# EAGLE design v3.2 (EAGLE 9.4.2)
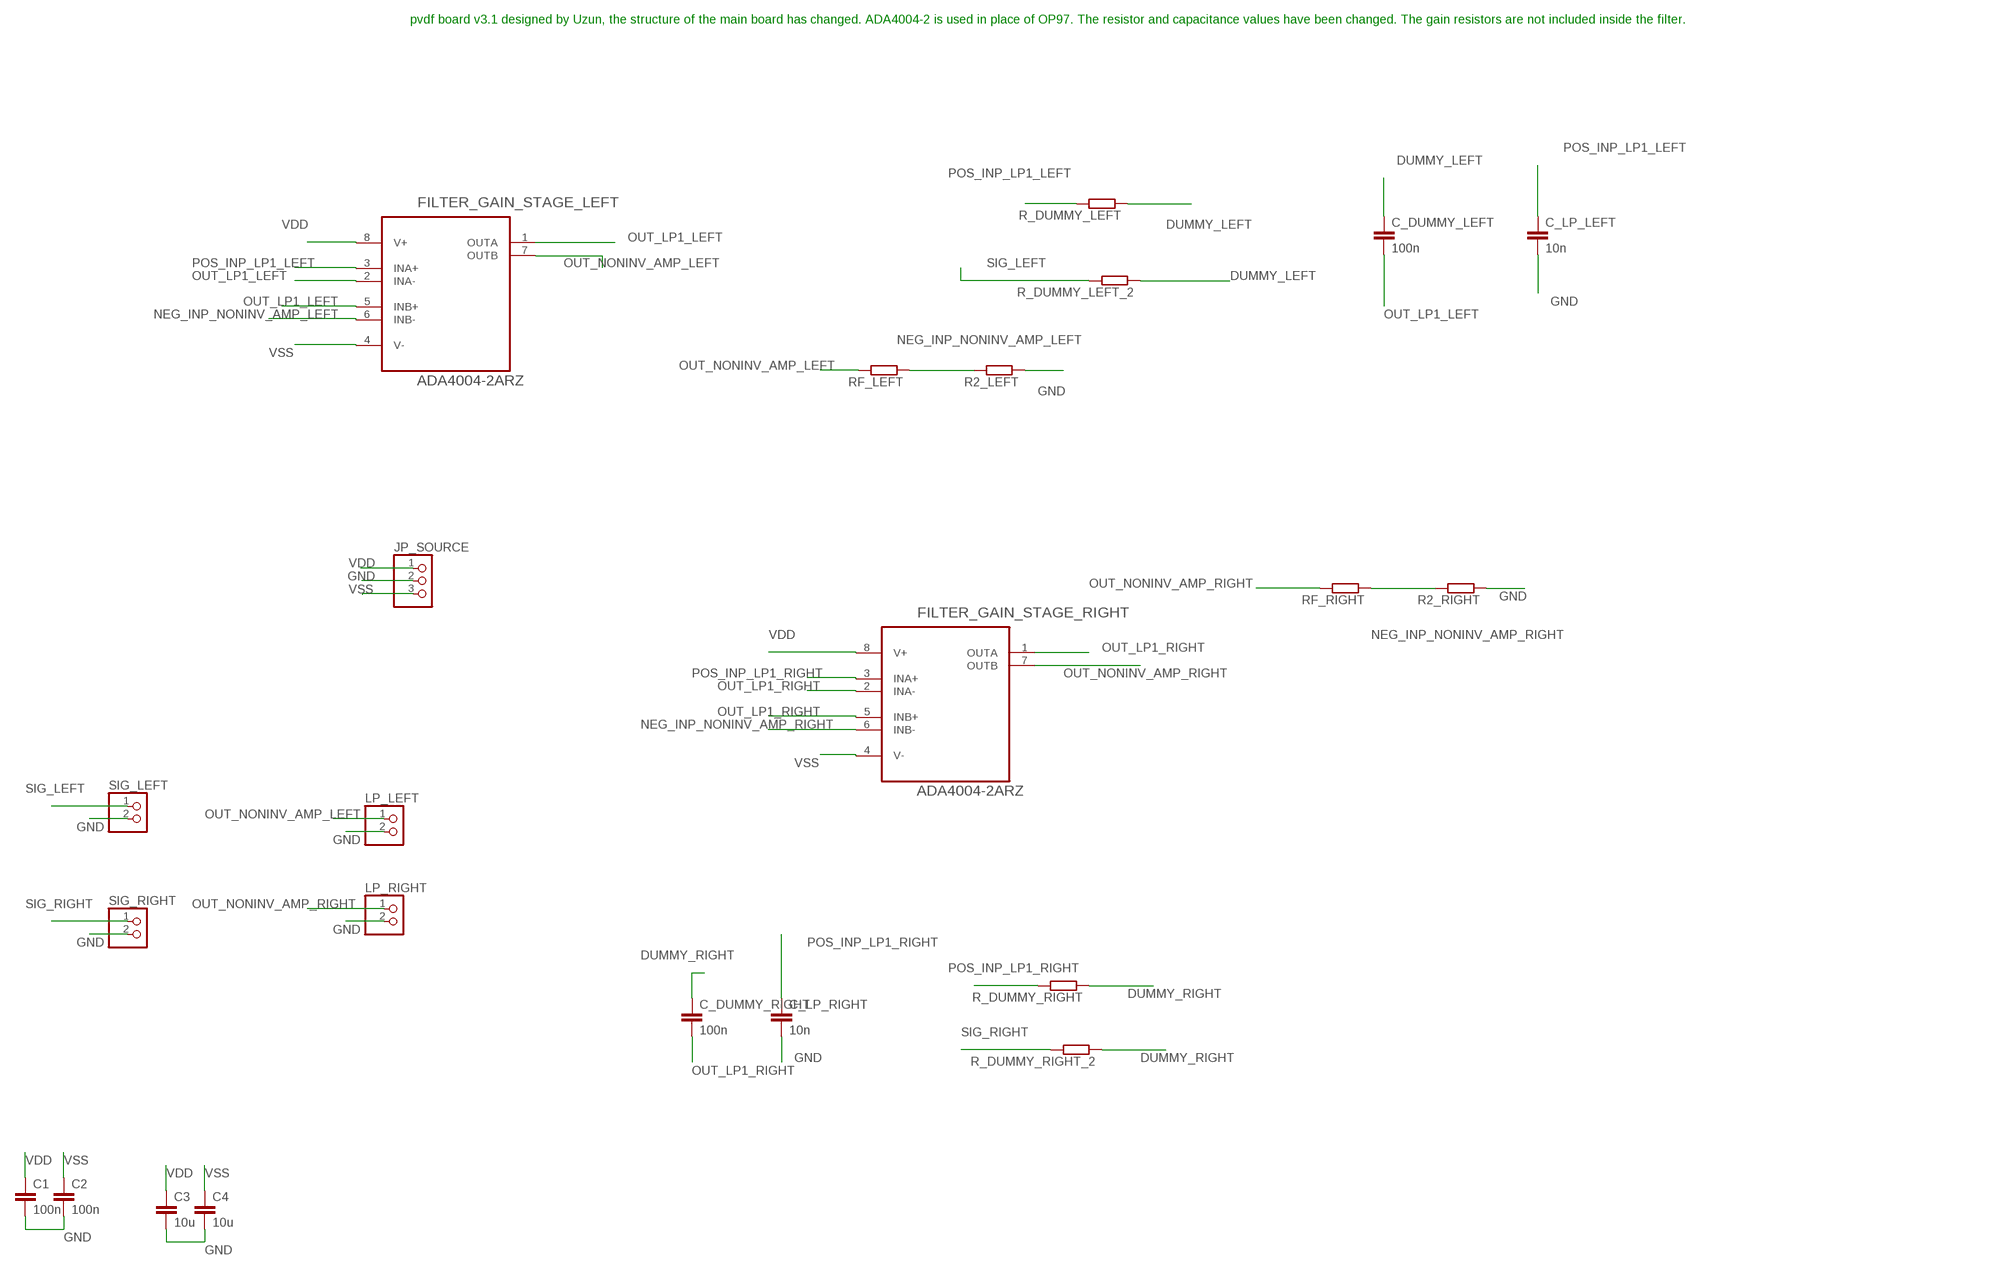
[diagram p0: schematic, sheet 1]

## Parts
C1  100n  C-EUC0805  [C0805]
C2  100n  C-EUC0805  [C0805]
C3  10u  C-EUC0805  [C0805]
C4  10u  C-EUC0805  [C0805]
C_DUMMY_LEFT  100n  C-EUC0805  [C0805]
C_DUMMY_RIGHT  100n  C-EUC0805  [C0805]
C_LP_LEFT  10n  C-EUC0805  [C0805]
C_LP_RIGHT  10n  C-EUC0805  [C0805]
FILTER_GAIN_STAGE_LEFT  ADA4004-2ARZ  [SOIC127P600X175-8N]
FILTER_GAIN_STAGE_RIGHT  ADA4004-2ARZ  [SOIC127P600X175-8N]
JP_SOURCE  PINHD-1X3  [1X03]
LP_LEFT  PINHD-1X2  [1X02]
LP_RIGHT  PINHD-1X2  [1X02]
R2_LEFT  6.8k  R-EU_M0805  [M0805]
R2_RIGHT  6.8k  R-EU_M0805  [M0805]
R_DUMMY_LEFT  1M  R-EU_M0805  [M0805]
R_DUMMY_LEFT_2  68k  R-EU_M0805  [M0805]
R_DUMMY_RIGHT  1M  R-EU_M0805  [M0805]
R_DUMMY_RIGHT_2  68k  R-EU_M0805  [M0805]
RF_LEFT  330k  R-EU_M0805  [M0805]
RF_RIGHT  330k  R-EU_M0805  [M0805]
SIG_LEFT  PINHD-1X2  [1X02]
SIG_RIGHT  PINHD-1X2  [1X02]

## Nets
DUMMY_LEFT: C_DUMMY_LEFT.1 R_DUMMY_LEFT.1 R_DUMMY_LEFT_2.1
DUMMY_RIGHT: C_DUMMY_RIGHT.1 R_DUMMY_RIGHT.1 R_DUMMY_RIGHT_2.1
GND: C1.2 C2.2 C3.2 C4.2 C_LP_LEFT.2 C_LP_RIGHT.2 JP_SOURCE.2 LP_LEFT.2 LP_RIGHT.2 R2_LEFT.1 R2_RIGHT.1 SIG_LEFT.2 SIG_RIGHT.2
NEG_INP_NONINV_AMP_LEFT: FILTER_GAIN_STAGE_LEFT.6(INB-) R2_LEFT.2 RF_LEFT.1
NEG_INP_NONINV_AMP_RIGHT: FILTER_GAIN_STAGE_RIGHT.6(INB-) R2_RIGHT.2 RF_RIGHT.1
OUT_LP1_LEFT: C_DUMMY_LEFT.2 FILTER_GAIN_STAGE_LEFT.1(OUTA) FILTER_GAIN_STAGE_LEFT.2(INA-) FILTER_GAIN_STAGE_LEFT.5(INB+)
OUT_LP1_RIGHT: C_DUMMY_RIGHT.2 FILTER_GAIN_STAGE_RIGHT.1(OUTA) FILTER_GAIN_STAGE_RIGHT.2(INA-) FILTER_GAIN_STAGE_RIGHT.5(INB+)
OUT_NONINV_AMP_LEFT: FILTER_GAIN_STAGE_LEFT.7(OUTB) LP_LEFT.1 RF_LEFT.2
OUT_NONINV_AMP_RIGHT: FILTER_GAIN_STAGE_RIGHT.7(OUTB) LP_RIGHT.1 RF_RIGHT.2
POS_INP_LP1_LEFT: C_LP_LEFT.1 FILTER_GAIN_STAGE_LEFT.3(INA+) R_DUMMY_LEFT.2
POS_INP_LP1_RIGHT: C_LP_RIGHT.1 FILTER_GAIN_STAGE_RIGHT.3(INA+) R_DUMMY_RIGHT.2
SIG_LEFT: R_DUMMY_LEFT_2.2 SIG_LEFT.1
SIG_RIGHT: R_DUMMY_RIGHT_2.2 SIG_RIGHT.1
VDD: C1.1 C3.1 FILTER_GAIN_STAGE_LEFT.8(V+) FILTER_GAIN_STAGE_RIGHT.8(V+) JP_SOURCE.1
VSS: C2.1 C4.1 FILTER_GAIN_STAGE_LEFT.4(V-) FILTER_GAIN_STAGE_RIGHT.4(V-) JP_SOURCE.3

## Notes on the sheet
- pvdf board v3.1 designed by Uzun, the structure of the main board has changed. ADA4004-2 is used in place of OP97. The resistor and capacitance values have been changed. The gain resistors are not included inside the filter.

## Library data of the parts
C1-C4 = resistor:C-EU: CAPACITOR, European symbol
C_DUMMY_LEFT C_DUMMY_RIGHT C_LP_LEFT C_LP_RIGHT = rcl:C-EU: CAPACITOR, European symbol; SPICEPREFIX: C
FILTER_GAIN_STAGE_LEFT FILTER_GAIN_STAGE_RIGHT = ADI-Phase-2:ADA4004-2ARZ: 36 V Precision Amplifiers; MPN: ADA4004-2ARZ; OC_FARNELL: 2077697; OC_NEWARK: 34P2953; PACKAGE: SOIC-8; SUPPLIER: Analog Devices
JP_SOURCE = pinhead:PINHD-1X3: PIN HEADER
LP_LEFT LP_RIGHT SIG_LEFT SIG_RIGHT = pinhead:PINHD-1X2: PIN HEADER
R2_LEFT R2_RIGHT R_DUMMY_LEFT R_DUMMY_LEFT_2 R_DUMMY_RIGHT R_DUMMY_RIGHT_2 RF_LEFT RF_RIGHT = rcl:R-EU_: RESISTOR, European symbol; SPICEPREFIX: R

## Board
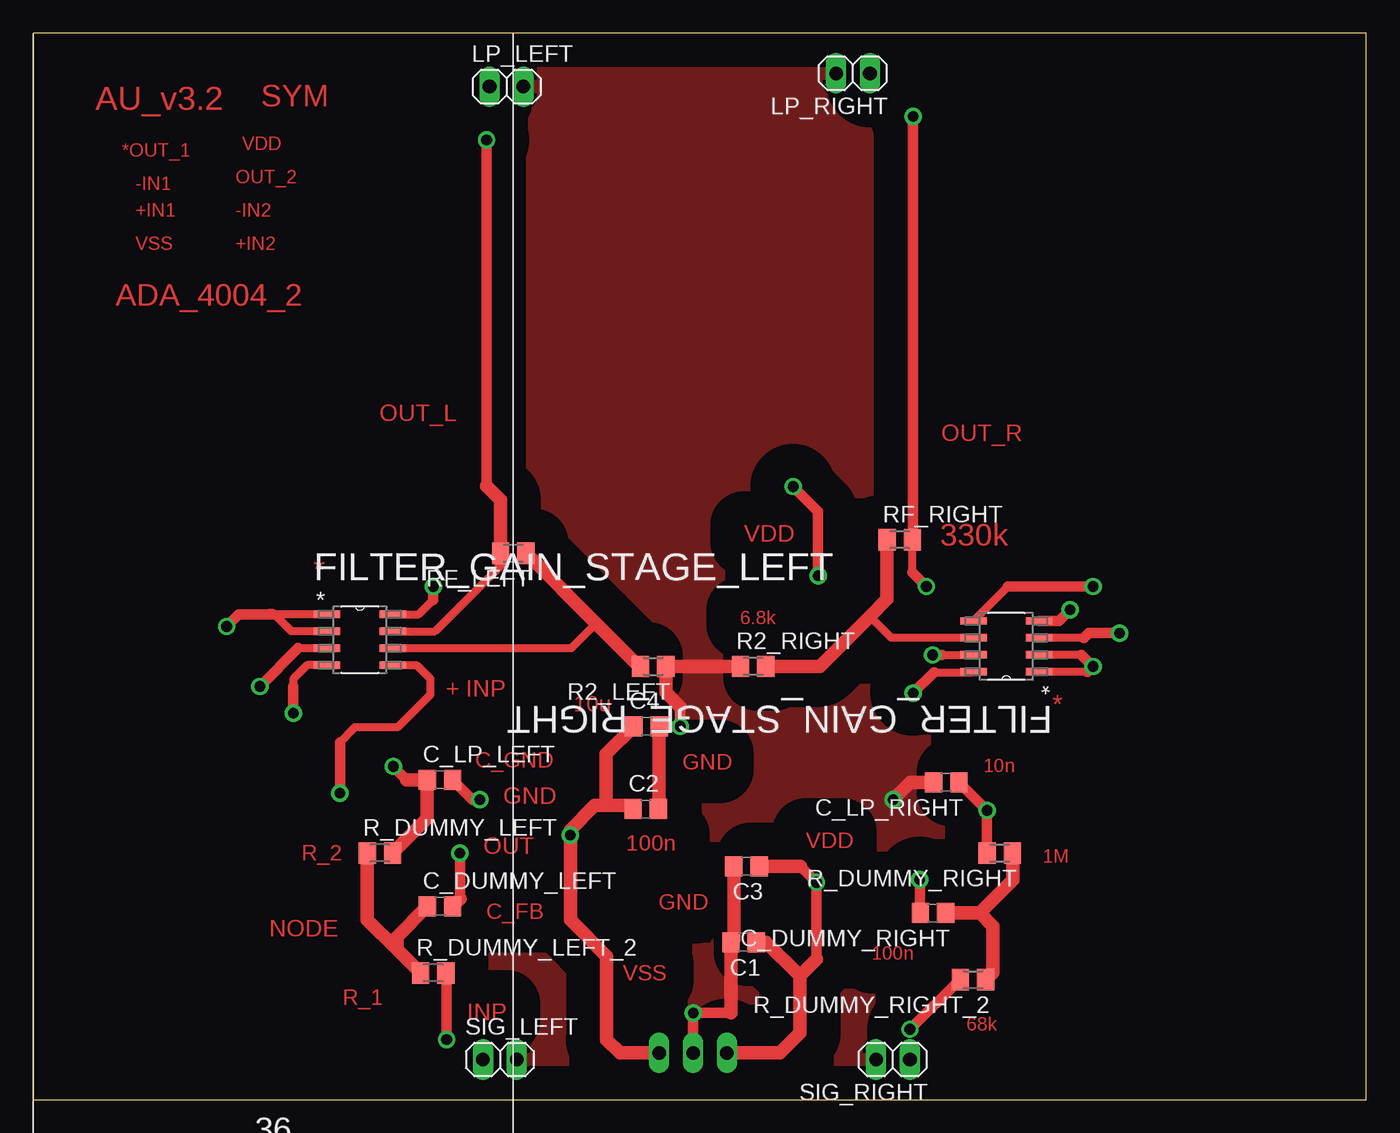
[diagram p1: board, top side]
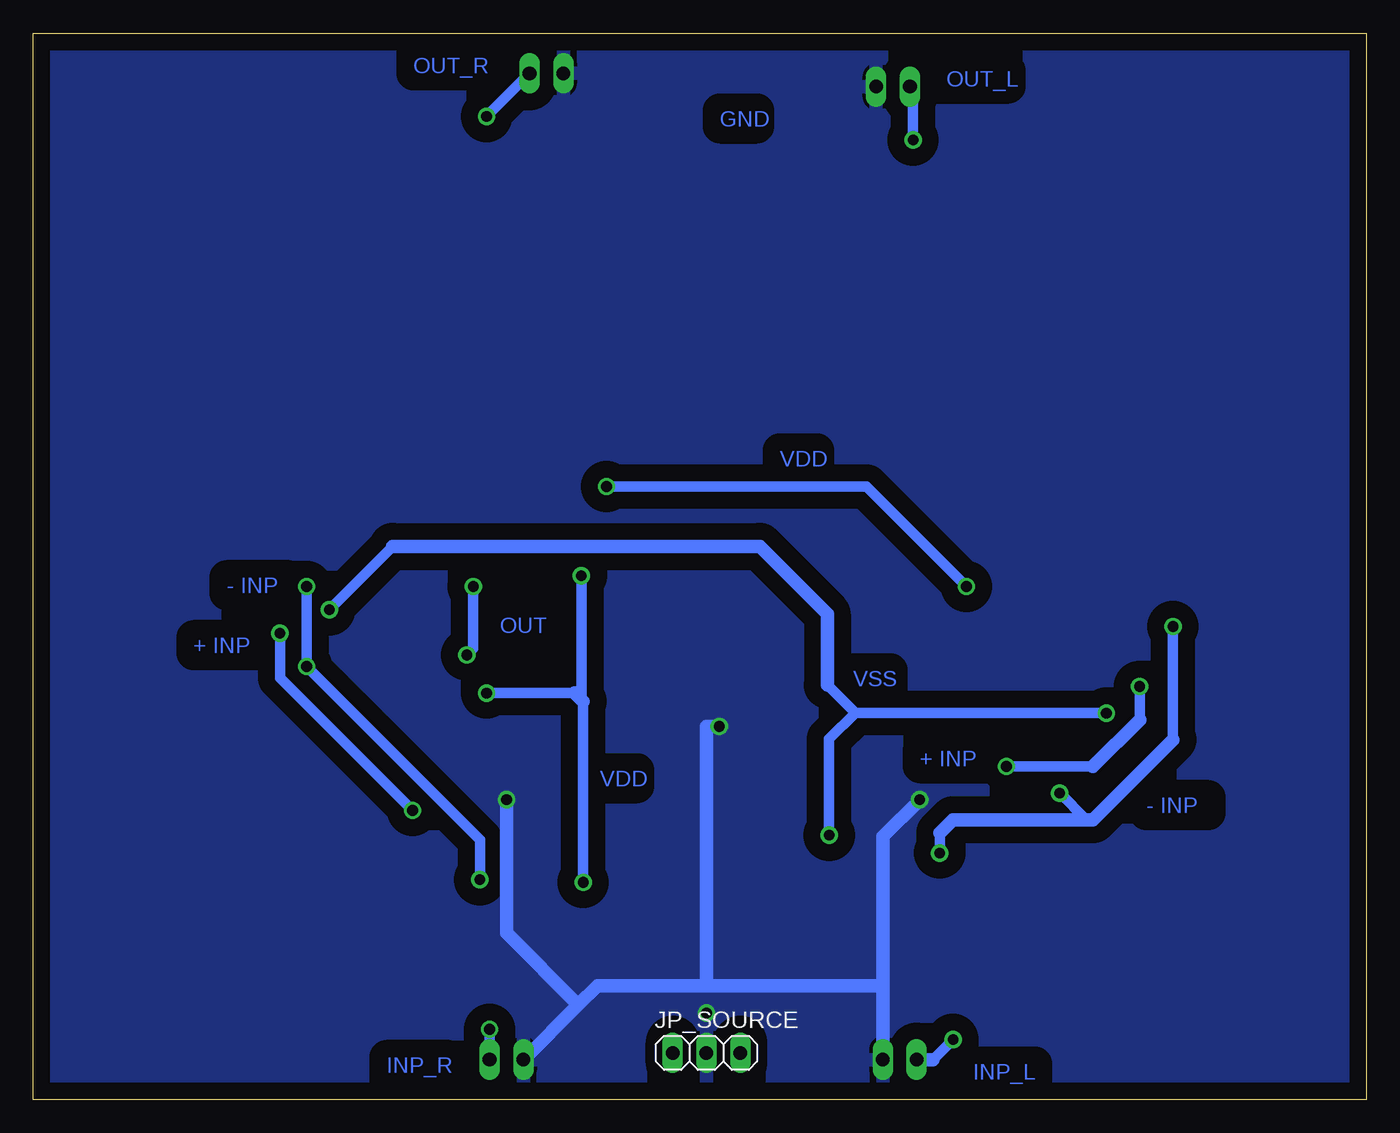
[diagram p2: board, bottom side, seen from below]

Size 100 x 80 mm. Coordinates in mm from the lower left corner, seen from the top.
Outline: 0,0 100,0 100,80 0,80 0,0
Copper layers (1*16): Top 0.035mm / dielectric 1.5mm / Bottom 0.035mm
Design rules "TM_medit_aetzen": minimum track width 10mil, minimum drill 8mil, track to track 10mil, track to pad 10mil, pad to pad 10mil, via to via 15mil, smd to smd 8mil, copper to edge 40mil, drill to drill 8mil, minimum pad ring 10mil, minimum via ring 8mil, stop-mask expansion 4mil, vias tented up to drill 0mil, thermal gap 10mil

### Footprints (pad centres in the part's own frame; a part is rotated, then mirrored left to right if it is on the bottom)
C0805 = smd 1.3 x 1.5: 1 -0.95,0; 2 0.95,0
SOIC127P600X175-8N = smd 1.981 x 0.559: 1 -2.464,1.905; 2 -2.464,0.635; 3 -2.464,-0.635; 4 -2.464,-1.905; 5 2.464,-1.905; 6 2.464,-0.635; 7 2.464,0.635; 8 2.464,1.905
1X03 = drill 1.016 long: 1 -2.54,0; 2 0,0; 3 2.54,0
1X02 = drill 1.016 long: 1 -1.27,0; 2 1.27,0
M0805 = smd 1.3 x 1.6: 1 -0.95,0; 2 0.95,0

### Placement (x,y rotation side)
C1  53.29,11.8 180 top
C2  45.94,21.8 0 top
C3  53.5,17.5 180 top
C4  46,28 0 top
C_DUMMY_LEFT  30.5,14.5 0 top
C_DUMMY_RIGHT  67.5,14 180 top
C_LP_LEFT  30.5,24 0 top
C_LP_RIGHT  68.49,23.8 180 top
FILTER_GAIN_STAGE_LEFT  24.5,34.5 0 top
FILTER_GAIN_STAGE_RIGHT  73,34 180 top
JP_SOURCE  49.5,3.5 0 bottom
LP_LEFT  35.5,76 0 top
LP_RIGHT  61.5,77 180 top
R2_LEFT  46.5,32.5 180 top
R2_RIGHT  54,32.5 0 top
R_DUMMY_LEFT  26,18.5 0 top
R_DUMMY_LEFT_2  30,9.5 0 top
R_DUMMY_RIGHT  72.5,18.5 180 top
R_DUMMY_RIGHT_2  70.5,9 180 top
RF_LEFT  36,41 180 top
RF_RIGHT  65,42 0 top
SIG_LEFT  35,3 0 top
SIG_RIGHT  64.5,3 180 top

### Tracks (layer width: path | path; a pad name or v marks a point on that pad's centre or on a via)
DUMMY_LEFT
  Top 1: 27.27,11.28 27.27,12.22 C_DUMMY_LEFT.1
  Top 1.016: R_DUMMY_LEFT.1 25.05,13.5 27.27,11.28 R_DUMMY_LEFT_2.1
DUMMY_RIGHT
  Top 1: C_DUMMY_RIGHT.1 71,14 | 71,14 72,13 72,9.55 R_DUMMY_RIGHT_2.1 | R_DUMMY_RIGHT.1 73.5,18.45 73.5,16.5 71,14
GND  (via drill 0.8 pad 1.3)
  Top 0.8: v33.5,22.5 32.95,22.5 C_LP_LEFT.2 | C4.2 v48.53,27.99 48.53,29.47 | 52.34,6.5 v49.5,6.5 JP_SOURCE.2
  Top 1: C4.2 46.95,21.86 C2.2 | C3.2 52.55,12.01 C1.2 52.34,6.5 | v64.5,22.5 65.8,23.8 C_LP_RIGHT.2 | 48.53,29.47 47.45,30.55 R2_LEFT.1 R2_RIGHT.1
  Bottom 1: 49.5,8.55 49.5,28 49.49,27.99 v48.53,27.99 | v33.5,22.5 36.27,19.73 36.27,8.5 | 36.27,8.5 SIG_LEFT.2 | 36.27,8.5 36.32,8.55 49.5,8.55 | SIG_RIGHT.2 59.12,7.12 | 59.12,7.12 57.68,8.55 49.5,8.55 | v64.5,22.5 64.5,12.5 59.12,7.12
  pour Bottom (isolate 1.27): 0,80 100,80 100,0 0,0
  pour Top (isolate 2.54): 0,80 100,80 100,0 0,0
NEG_INP_NONINV_AMP_LEFT
  Top 0.6: FILTER_GAIN_STAGE_LEFT.6 40.37,33.87 42.23,35.73
  Top 1.016: RF_LEFT.1 42.23,35.73 45.45,32.5 R2_LEFT.2
NEG_INP_NONINV_AMP_RIGHT
  Top 0.6: FILTER_GAIN_STAGE_RIGHT.6 64.36,34.63 62.75,36.25
  Top 1: R2_RIGHT.2 59,32.5 62.75,36.25 64.05,37.55 RF_RIGHT.1
OUT_LP1_LEFT  (via drill 0.8 pad 1.3)
  Top 0.6: FILTER_GAIN_STAGE_LEFT.5 28.75,32.59 29.77,31.58 29.77,30.37 27.32,27.92 24.12,27.92 23,26.8 | FILTER_GAIN_STAGE_LEFT.1 18,36.41 17.71,36.41 17.62,36.5
  Top 0.61: FILTER_GAIN_STAGE_LEFT.2 19.36,35.13 18,36.5 17.62,36.5
  Top 0.8: 18,36.41 15.4,36.41 v14.5,35.5 | v23,23 23,26.8 | v32,18.5 32,15.05
  Top 1.016: 32,15.05 C_DUMMY_LEFT.2
  Bottom 0.8: v14.5,35.5 14.5,27 | v23,23 21,21 20.5,21 | 32,20 v32,18.5
  Bottom 1: 32,20 31,21 20.5,21 14.5,27
OUT_LP1_RIGHT  (via drill 0.8 pad 1.3)
  Top 0.6: 73.13,38.5 FILTER_GAIN_STAGE_RIGHT.5 | 78.64,33.37 FILTER_GAIN_STAGE_RIGHT.2 | 79.09,32.09 FILTER_GAIN_STAGE_RIGHT.1
  Top 0.8: v79.5,38.5 73.13,38.5 | 78.64,33.37 v79.5,32.5 79.09,32.09 | 66.5,14.05 v66.5,16.5
  Top 1: 66.5,14.05 C_DUMMY_RIGHT.2
  Bottom 0.8: v66.5,16.5 66.5,19.02 66.5,19.5 v79.5,32.5 v79.5,38.5
OUT_NONINV_AMP_LEFT  (via drill 0.8 pad 1.3)
  Top 0.6: 35.05,40.35 35.05,40.05 32,37
  Top 0.61: FILTER_GAIN_STAGE_LEFT.7 30.14,35.13 32,37
  Top 0.8: v34,72 34,46.05
  Top 1: 34,46.05 35.05,45 RF_LEFT.2 35.05,40.35
  Bottom 0.8: v34,72 34,75.77 LP_LEFT.1
OUT_NONINV_AMP_RIGHT  (via drill 0.8 pad 1.3)
  Top 0.6: 65.95,39.55 65.95,41.8 RF_RIGHT.2 | v67.48,33.36 FILTER_GAIN_STAGE_RIGHT.7
  Top 0.8: v67,38.5 65.95,39.55 | v67.48,33.36 68.17,33.36 | v66,73.77 66,41.85 65.95,41.8
  Bottom 0.8: LP_RIGHT.1 v66,73.77 | v67,38.5 67,33.84 v67.48,33.36
POS_INP_LP1_LEFT  (via drill 0.8 pad 1.3)
  Top 0.61: 19.86,33.87 FILTER_GAIN_STAGE_LEFT.3
  Top 0.8: v17,31 19.86,33.87 | v27,25 28,24
  Top 1: R_DUMMY_LEFT.2 29.55,21.1 C_LP_LEFT.1 28,24
  Bottom 0.8: v17,31 17,28.5 | 20.5,25 v27,25
  Bottom 1: 17,28.5 20.5,25
POS_INP_LP1_RIGHT  (via drill 0.8 pad 1.3)
  Top 0.6: 78.83,34.63 FILTER_GAIN_STAGE_RIGHT.3
  Top 0.8: v81.5,35 79.2,35 78.83,34.63 | R_DUMMY_RIGHT.2 v71.55,21.69 C_LP_RIGHT.1
  Bottom 0.8: v71.55,21.69 81.5,31.64 v81.5,35
SIG_LEFT  (via drill 0.8 pad 1.3)
  Top 0.8: v31,4.5 31,9.45 R_DUMMY_LEFT_2.2
  Bottom 0.8: v31,4.5 32.5,3
  Bottom 1: 32.5,3 SIG_LEFT.1
SIG_RIGHT  (via drill 0.8 pad 1.3)
  Top 0.8: v65.77,5.27 69.5,9 R_DUMMY_RIGHT_2.2
  Bottom 0.8: v65.77,5.27 SIG_RIGHT.1
VDD  (via drill 0.8 pad 1.3)
  Top 0.6: 28.91,36.41 30,37.5 | 67.59,32.06 70.5,32.06 FILTER_GAIN_STAGE_RIGHT.8
  Top 0.61: FILTER_GAIN_STAGE_LEFT.8 28.91,36.41
  Top 0.8: 30,37.5 v30,38.5 | v57,46 58.88,44.12 v58.88,39.31 | v66,30.5 67.56,32.06 67.59,32.06 | 58.75,10.53 v58.75,16.29 57.54,17.5
  Top 1: 58.75,10.53 57.5,9.28 | 57.5,6.5 57.5,9.28 | 57.54,17.5 C3.1 | C1.1 54.98,11.8 57.5,9.28
  Top 1.016: JP_SOURCE.1 56,3.5 57.5,5 57.5,6.5
  Bottom 0.8: v66,30.5 59.38,30.5 58.88,30 | v58.88,39.31 58.88,30 | 58.88,30 58.75,29.87 v58.75,16.29 | v56.99,45.99 v57,46 37.5,46 v30,38.5
  Bottom 1: 59.38,30.5 58.75,29.87
VSS  (via drill 0.8 pad 1.3)
  Top 0.6: FILTER_GAIN_STAGE_LEFT.4 20.55,32.59 19.5,31.55 19.5,31 | v77.8,36.74
  Top 0.8: 19.5,31 v19.5,29 | v77.8,36.74 76.95,35.91 FILTER_GAIN_STAGE_RIGHT.4
  Top 1: 43,4.5 43,10.76 40.29,13.47 v40.29,19.84 40.29,20.24 42.12,22.07 42.97,22.07 | 42.97,22.07 44.72,22.07 C2.1 | 42.97,22.07 42.97,25.92 C4.1
  Top 1.016: JP_SOURCE.3 44,3.5 43,4.5
  Bottom 0.8: v19.5,29 38.33,29 | 38.33,29 40.42,31.09 | v77.8,36.74 73.04,41.5 | v40.29,19.84 40.29,27.04 38.33,29
  Bottom 1: 40.42,31.09 40.42,36.42 45.5,41.5 73.04,41.5

### Text on the board
Top: AU_v3.2 | SYM | *OUT_1 | VDD | OUT_2 | -IN1 | +IN1 | -IN2 | VSS | +IN2 | ADA_4004_2 | OUT_L | OUT_R | VDD | 330k | * | 6.8k | + INP | 10u | * | C_GND | GND | 10n | GND | 100n | VDD | R_2 | OUT | 1M | C_FB | GND | NODE | 100n | VSS | R_1 | INP | 68k
Bottom: OUT_R | OUT_L | GND | VDD | - INP | OUT | + INP | VSS | + INP | VDD | - INP | INP_L | INP_R